# EAGLE design 副机 插座 v0.3 (EAGLE 6.3)
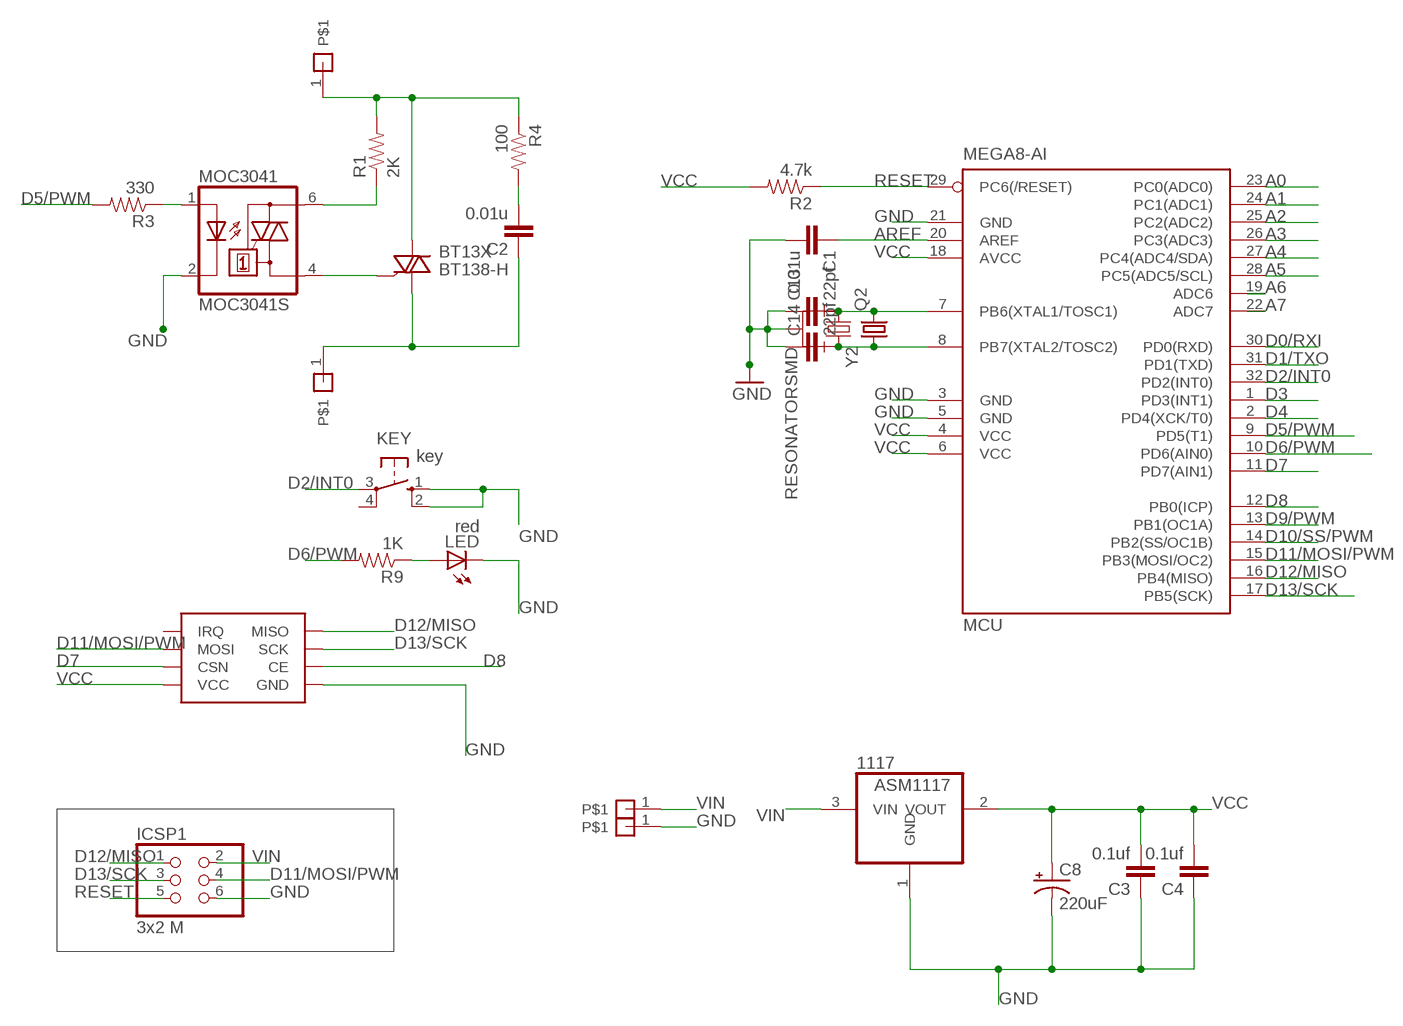
[diagram p0: schematic, sheet 1]

## Parts
1117  ASM1117  REG1117  [SOT223]
BT13X  BT138-H  [TO220BH]
C1  0.01u  CAP0603-CAP  [0603-CAP]
C2  0.01u  C-EU050-024X044  [C050-024X044]
C3  0.1uf  CAP0603-CAP  [0603-CAP]
C4  0.1uf  CAP0603-CAP  [0603-CAP]
C8  220uF  CAP_POL3528  [EIA3528]
C13  22pf  CAP0603-CAP  [0603-CAP]
C14  22pf  CAP0603-CAP  [0603-CAP]
ICSP1  3x2 M  PINHD-2X3  [2X03]
KEY  key  10-XX  [B3F-10XX]
LED  red  LED3MM  [LED3MM]
MCU  MEGA8-AI  [TQFP32-08]
MOC3041  MOC3041S  [DIL6-SMD]
Q2  CRYSTALHC49S  [HC49/S]
R1  2K  RESISTOR1206  [1206]
R2  4.7k  RESISTOR0603-RES  [0603-RES]
R3  330  RESISTOR0603-RES  [0603-RES]
R4  100  RESISTOR1206  [1206]
R9  1K  RESISTOR0603-RES  [0603-RES]
U$1  PIN1  [PIN1]
U$2  PIN1  [PIN1]
U$3  PIN1  [PIN1]
U$4  PIN1  [PIN1]
U$6  NRF  [NRF]
Y2  RESONATORSMD  [RESONATOR-SMD]

## Nets
A0: MCU.23(PC0(ADC0))
A1: MCU.24(PC1(ADC1))
A2: MCU.25(PC2(ADC2))
A3: MCU.26(PC3(ADC3))
A4: MCU.27(PC4(ADC4/SDA))
A5: MCU.28(PC5(ADC5/SCL))
A6: MCU.19(ADC6)
A7: MCU.22(ADC7)
AREF: C1.1 MCU.20(AREF)
D0/RXI: MCU.30(PD0(RXD))
D1/TXO: MCU.31(PD1(TXD))
D2/INT0: KEY.3(P) MCU.32(PD2(INT0))
D3: MCU.1(PD3(INT1))
D4: MCU.2(PD4(XCK/T0))
D5/PWM: MCU.9(PD5(T1)) R3.2
D6/PWM: MCU.10(PD6(AIN0)) R9.2
D7: MCU.11(PD7(AIN1)) U$6.P$4(CSN)
D8: MCU.12(PB0(ICP)) U$6.P$3(CE)
D9/PWM: MCU.13(PB1(OC1A))
D10/SS/PWM: MCU.14(PB2(SS/OC1B))
D11/MOSI/PWM: ICSP1.4 MCU.15(PB3(MOSI/OC2)) U$6.P$6(MOSI)
D12/MISO: ICSP1.1 MCU.16(PB4(MISO)) U$6.P$7(MISO)
D13/SCK: ICSP1.3 MCU.17(PB5(SCK)) U$6.P$5(SCK)
GND: 1117.1(GND) C1.2 C3.1 C4.1 C8.C(-) C13.1 C14.1 ICSP1.6 KEY.1(S) KEY.2(S1) LED.K(C) MCU.3(GND) MCU.5(GND) MCU.21(GND) MOC3041.2(C) U$4.1 U$6.P$1(GND) Y2.2
IN: BT13X.T2(A2) R1.2 R4.1 U$2.1
N$1: MOC3041.6(A2) R1.1
N$2: BT13X.G MOC3041.4(A1)
N$6: C2.2 R4.2
N$15: LED.A R9.1
N$34: C13.2 MCU.7(PB6(XTAL1/TOSC1)) Q2.2 Y2.1
N$35: C14.2 MCU.8(PB7(XTAL2/TOSC2)) Q2.1 Y2.3
OUT: BT13X.T1(A1) C2.1 U$1.1
P1: MOC3041.1(A) R3.1
RESET: ICSP1.5 MCU.29(PC6(/RESET)) R2.1
VCC: 1117.2(VOUT) C3.2 C4.2 C8.A(+) MCU.4(VCC) MCU.6(VCC) MCU.18(AVCC) R2.2 U$6.P$2(VCC)
VIN: 1117.3(VIN) ICSP1.2 U$3.1
Unconnected: KEY.4(P1) U$6.P$8(IRQ)

## Library data of the parts
1117 = burr-brown:REG1117: 800mA and 1A Low Dropout (LDO) Positive Regulator 1.8V, 2.5V, 2.85V, 3.3V, 5V, and Adj; MPN: REG1117; OC_FARNELL: 1097566; OC_NEWARK: 14P6981
BT13X = triac:BT138: TRIAC Source: http://www.semiconductors.philips.com BT138_SERIES_2.pdf
C1 = MY2:CAP: Capacitor Standard 0603 ceramic capacitor, and 0.1" leaded capacitor.
C2 = resistor:C-EU: CAPACITOR, European symbol
C3 C4 = MY:CAP: Capacitor Standard 0603 ceramic capacitor, and 0.1" leaded capacitor.
C8 = MY:CAP_POL: Capacitor Polarized These are standard SMD and PTH capacitors. Normally 10uF, 47uF, and 100uF in electrolytic and tantalum varieties. Always verify the external diameter of the through hole cap, it varies with capacity, voltage, and manufacturer. The EIA devices should be standard.
C13 C14 = 00my:CAP: Capacitor Standard 0603 ceramic capacitor, and 0.1" leaded capacitor.
ICSP1 = SmartPrj:PINHD-2X3: PIN HEADER
KEY = switch-omron:10-XX: OMRON SWITCH; MPN: B3F-1000; OC_FARNELL: 176432; OC_NEWARK: 36M3542
LED = led:LED: LED OSRAM: - CHIPLED LG R971, LG N971, LY N971, LG Q971, LY Q971, LO R971, LY R971 LH N974, LH R974 LS Q976, LO Q976, LY Q976 LO Q996 - Hyper CHIPLED LW Q18S LB Q993, LB Q99A, LB R99A - SideLED LS A670, LO A670, LY A670, LG A670, LP A670 LB A673, LV A673, LT A673, LW A673 LH A674 LY A675 LS A676, LA A676, LO A676, LY A676, LW A676 LS A679, LY A679, LG A679 - Hyper Micro SIDELED® LS Y876, LA Y876, LO Y876, LY Y876 LT Y87S - SmartLED LW L88C, LW L88S LB L89C, LB L89S, LG L890 LS L89K, LO L89K, LY L89K LS L896, LA L896, LO L896, LY L896 - TOPLED LS T670, LO T670, LY T670, LG T670, LP T670 LSG T670, LSP T670, LSY T670, LOP T670, LYG T670 LG T671, LOG T671, LSG T671 LB T673, LV T673, LT T673, LW T673 LH T674 LS T676, LA T676, LO T676, LY T676, LB T676, LH T676, LSB T676, LW T676 LB T67C, LV T67C, LT T67C, LS T67K, LO T67K, LY T67K, LW E67C LS E67B, LA E67B, LO E67B, LY E67B, LB E67C, LV E67C, LT E67C LW T67C LS T679, LY T679, LG T679 LS T770, LO T770, LY T770, LG T770, LP T770 LB T773, LV T773, LT T773, LW T773 LH T774 LS E675, LA E675, LY E675, LS T675 LS T776, LA T776, LO T776, LY T776, LB T776 LHGB T686 LT T68C, LB T68C - Hyper Mini TOPLED® LB M676 - Mini TOPLED Santana® LG M470 LS M47K, LO M47K, LY M47K Source: http://www.osram.convergy.de LUXEON: - LUMILED® LXK2-PW12-R00, LXK2-PW12-S00, LXK2-PW14-U00, LXK2-PW14-V00 LXK2-PM12-R00, LXK2-PM12-S00, LXK2-PM14-U00 LXK2-PE12-Q00, LXK2-PE12-R00, LXK2-PE12-S00, LXK2-PE14-T00, LXK2-PE14-U00 LXK2-PB12-K00, LXK2-PB12-L00, LXK2-PB12-M00, LXK2-PB14-N00, LXK2-PB14-P00, LXK2-PB14-Q00 LXK2-PR12-L00, LXK2-PR12-M00, LXK2-PR14-Q00, LXK2-PR14-R00 LXK2-PD12-Q00, LXK2-PD12-R00, LXK2-PD12-S00 LXK2-PH12-R00, LXK2-PH12-S00 LXK2-PL12-P00, LXK2-PL12-Q00, LXK2-PL12-R00 Source: www.luxeon.com KINGBRIGHT: KA-3528ASYC Source: www.kingbright.com
MCU = atmel:MEGA8: MICROCONTROLLER 8 Kbytes FLASH, 1 kbytes SRAM, 512 bytes EEPROM, USART, 6-channel 10 bit ADC, 2-channel 8 bit ADC Pin compatible with Atmega48, ATMega88, ATMega168 Source: avr.lbr; MPN: ATMEGA8-16AU; OC_FARNELL: 9171371; OC_NEWARK: 73M8863
MOC3041 = optocoupler:MOC30*: 6-Pin DIP Zero-Cross Optoisolators Triac Driver Output (250/400 Volt Peak) Source: http://www.fairchildsemi.com/ds/MO/MOC3043-M.pdf; MF: FAIRCHILD SEMICONDUCTOR; MPN: MOC3041S-M; OC_FARNELL: unknown; OC_NEWARK: 05C2885
Q2 = crystal:CRYSTAL: CRYSTAL; OC_FARNELL: 1667008; OC_NEWARK: unknown
R1 R4 = MY3:RESISTOR: Resistor Basic schematic elements and footprints for 0603, 1206, and PTH 1/10th watt (small) resistors.
R2 R3 R9 = MY:RESISTOR: Resistor Basic schematic elements and footprints for 0603, 1206, and PTH 1/10th watt (small) resistors.
U$1-U$4 = PKJ:PIN1
U$6 = PKJ:NRF
Y2 = MY:RESONATOR: Resonator Small SMD resonator. This is the itty bitty 10/20MHz resonators with built in caps. CSTCE10M0G55 and CSTCE20M0V53. Footprint has been reviewed closely but hasn't been tested yet.

## Net classes
0 default: width 0.254 mm, clearance 0.254 mm
1 power: width 0.381 mm
2 gnd: width 0.305 mm, drill 0.559 mm, clearance 0.254 mm
3 usbvcc: width 0.508 mm, drill 0.61 mm, clearance 0.254 mm

## Board
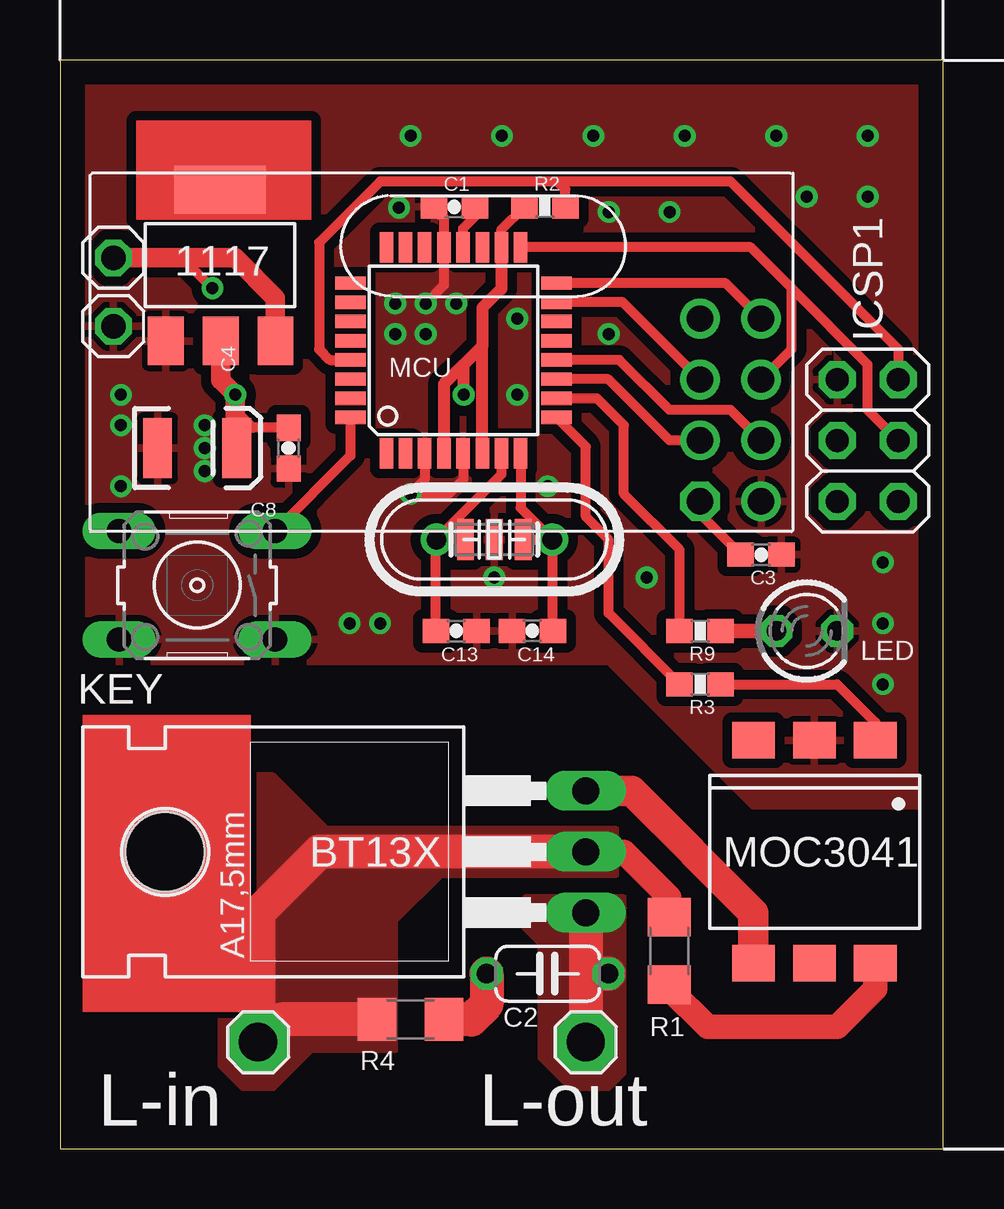
[diagram p1: board, top side]
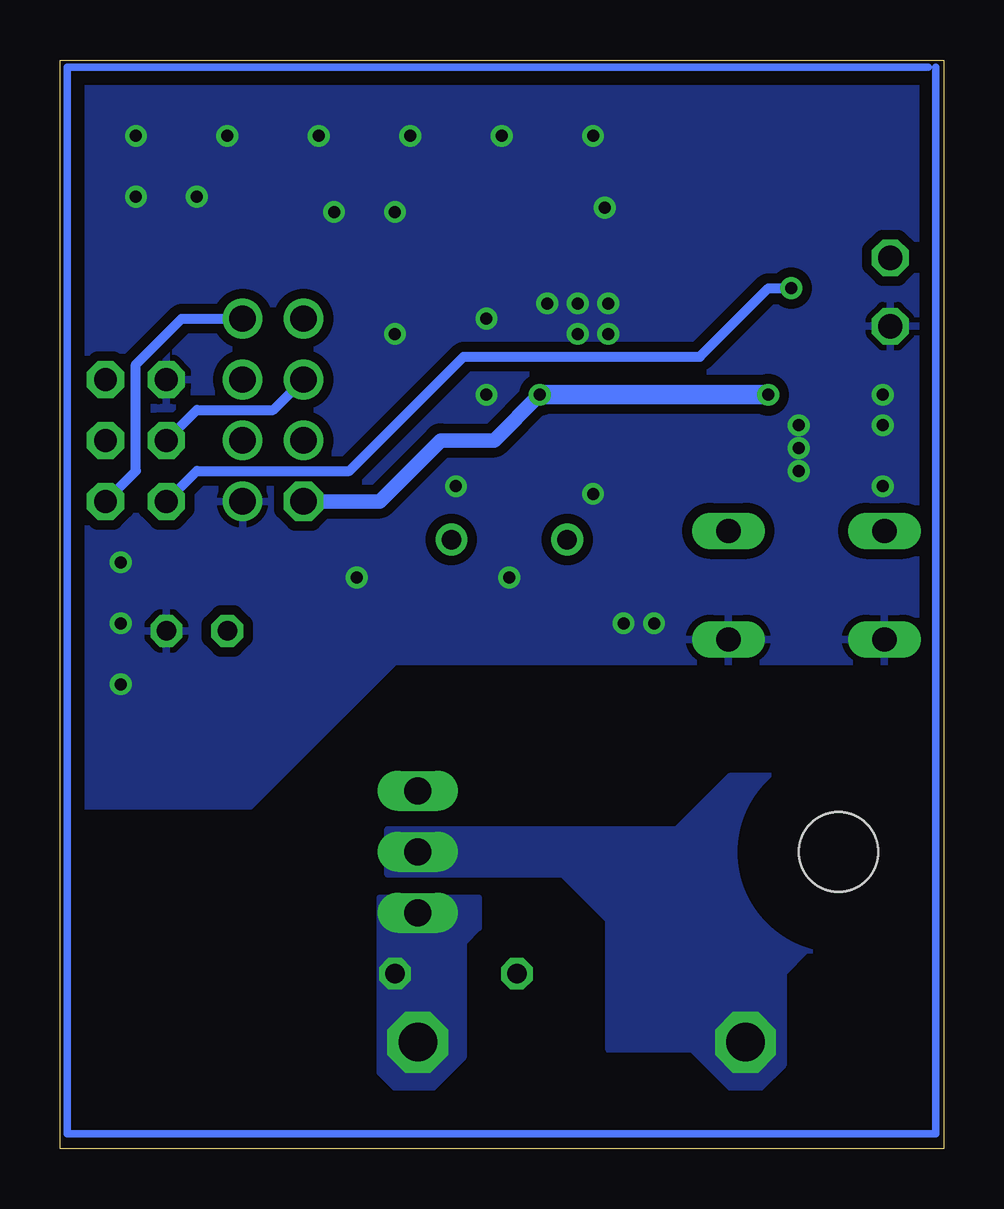
[diagram p2: board, bottom side, seen from below]

Size 36.81 x 45.39 mm. Coordinates in mm from the lower left corner, seen from the top.
Outline: 0,0 36.81,0 36.81,45.39 0,45.39 0,0
Copper layers (1*16): Top 0.035mm / dielectric 1.5mm / Bottom 0.035mm
Design rules "default": minimum track width 10mil, minimum drill 24mil, track to track 8mil, track to pad 8mil, pad to pad 8mil, via to via 8mil, smd to smd 8mil, copper to edge 40mil, drill to drill 8mil, minimum pad ring 10mil, minimum via ring 8mil, stop-mask expansion 4mil, vias tented up to drill 0mil, thermal gap 10mil

### Footprints (pad centres in the part's own frame; a part is rotated, then mirrored left to right if it is on the bottom)
SOT223 = smd 1.499 x 2.007: 1 -2.261,-3.15; 2 0.025,-3.15; 3 2.311,-3.15 | smd 3.81 x 2.007: 4 0,3.15
TO220BH = drill 1.118 long: G 2.54,-6.35; T1 -2.54,-6.35; T2 0,-6.35 | hole 3.302: 0,11.176
0603-CAP = smd 1.1 x 1: 1 -0.85,0; 2 0.85,0
C050-024X044 = drill 0.813 octagon: 1 -2.54,0; 2 2.54,0
EIA3528 = smd 1.2 x 2.5: A 1.65,0; C -1.65,0
2X03 = drill 0.95 pad 1.55 octagon: 1 -2.54,-1.27; 2 -2.54,1.27; 3 0,-1.27; 4 0,1.27; 5 2.54,-1.27; 6 2.54,1.27
B3F-10XX = drill 1.016 long: 1 -3.251,2.261; 2 3.251,2.261; 3 -3.251,-2.261; 4 3.251,-2.261
LED3MM = drill 0.813 octagon: A -1.27,0; K 1.27,0
TQFP32-08 = smd 1.27 x 0.559: 1 -4.293,2.8; 2 -4.293,2; 3 -4.293,1.2; 4 -4.293,0.4; 5 -4.293,-0.4; 6 -4.293,-1.2; 7 -4.293,-2; 8 -4.293,-2.8; 17 4.293,-2.8; 18 4.293,-2; 19 4.293,-1.2; 20 4.293,-0.4; 21 4.293,0.4; 22 4.293,1.2; 23 4.293,2; 24 4.293,2.8 | smd 0.559 x 1.27: 9 -2.8,-4.293; 10 -2,-4.293; 11 -1.2,-4.293; 12 -0.4,-4.293; 13 0.4,-4.293; 14 1.2,-4.293; 15 2,-4.293; 16 2.8,-4.293; 25 2.8,4.293; 26 2,4.293; 27 1.2,4.293; 28 0.4,4.293; 29 -0.4,4.293; 30 -1.2,4.293; 31 -2,4.293; 32 -2.8,4.293
DIL6-SMD = smd 1.78 x 1.52: 1 -2.54,-4.645; 2 0,-4.645; 3 2.54,-4.645; 4 2.54,4.645; 5 0,4.645; 6 -2.54,4.645
HC49/S = drill 0.813: 1 -2.413,0; 2 2.413,0
1206 = smd 1.6 x 1.8: 1 -1.4,0; 2 1.4,0
0603-RES = smd 1.1 x 1: 1 -0.85,0; 2 0.85,0
PIN1 = drill 1.016 octagon: 1 0,0
NRF = drill 1.1: P$1 2.54,-2.54; P$3 2.54,0; P$4 0,0; P$5 2.54,2.54; P$6 0,2.54; P$7 2.54,5.08; P$8 0,5.08 | drill 1.1 octagon: P$2 0,-2.54
RESONATOR-SMD = smd 0.7 x 1.7: 1 -1.2,0; 2 0,0; 3 1.2,0

### Placement (x,y rotation side)
1117  6.67,36.83 0 top
BT13X  15.56,12.38 90 top
C1  16.43,39.27 180 top
C2  20.32,7.3 180 top
C3  29.21,24.77 180 top
C4  9.53,29.21 90 top
C8  5.71,29.21 0 top
C13  16.51,21.59 180 top
C14  19.68,21.59 0 top
ICSP1  33.66,29.53 90 top
KEY  5.71,23.49 180 top
LED  31.11,21.59 0 top
MCU  16.4,33.29 90 top
MOC3041  31.43,12.38 180 top
Q2  18.1,25.4 180 top
R1  25.39,8.26 90 top
R2  20.21,39.28 180 top
R3  26.67,19.37 180 top
R4  14.61,5.4 0 top
R9  26.67,21.59 180 top
U$1  21.91,4.45 0 top
U$2  8.26,4.45 0 top
U$3  2.22,37.15 0 top
U$4  2.22,34.29 0 top
U$6  26.67,29.53 0 top
Y2  18.1,25.4 0 top

### Tracks (layer width: path | path; a pad name or v marks a point on that pad's centre or on a via)
AREF
  Top 0.406: MCU.20 16.8,38.37 17.28,38.86 C1.1
D2/INT0
  Top 0.406: MCU.32 12.1,28.89 KEY.3
D5/PWM
  Top 0.406: R3.2 22.86,22.33 22.86,25.4 21.91,26.35 21.91,29.27 MCU.9
D6/PWM
  Top 0.406: MCU.10 22.37,31.29 23.49,30.16 23.49,27.31 25.82,24.98 R9.2
D7
  Top 0.406: U$6.P$4 25.4,29.53 22.84,32.09 MCU.11
D8
  Top 0.406: U$6.P$3 27.94,30.8 25.4,30.8 23.31,32.89 MCU.12
D11/MOSI/PWM
  Top 0.406: U$6.P$6 23.45,35.29 MCU.15
  Bottom 0.406: ICSP1.4 31.11,30.8 27.94,30.8 U$6.P$6
D12/MISO
  Top 0.406: U$6.P$7 27.73,36.09 MCU.16
  Bottom 0.406: ICSP1.1 33.66,28.26 33.66,32.7 31.75,34.61 U$6.P$7
D13/SCK
  Top 0.406: U$6.P$5 30.48,33.34 30.48,35.88 | 30.48,35.88 28.78,37.58 MCU.17 | ICSP1.3 33.66,30.8 33.66,32.7 30.48,35.88
GND  (via drill 0.5)
  Top 0.406: MCU.3 15.2,27.9 v14.61,27.31 16.19,27.31 16.8,27.91 MCU.5 | v15.24,35.24 16,36 MCU.21 16,38.8 15.54,39.26 15.57,39.26 C1.2
  other vias: 24.45,23.81 16.51,35.24 33.66,39.69 31.11,39.69 25.4,39.05 22.86,39.05 19.05,31.43 6.03,28.26 34.29,21.91 34.29,24.45 34.29,19.37 20.32,27.62 18.1,23.81 14.12,39.23 15.24,33.97 13.97,33.97 13.97,35.24 33.66,42.23 29.84,42.23 26.04,42.23 22.22,42.23 18.41,42.23 14.61,42.23 22.22,42.23 22.86,33.97 12.06,21.91 13.34,21.91 2.54,30.16 2.54,27.62 2.54,31.43 19.05,34.61 6.03,29.21 6.03,30.16
  pour Bottom (isolate 0.406): 0.64,44.45 36.2,44.45 36.2,14.29 28.89,14.29 22.86,20.32 0.64,20.32
  pour Top (isolate 0.406): 0.64,44.45 36.2,44.45 36.2,14.29 28.89,14.29 22.86,20.32 0.64,20.32
IN  (via drill 1.6 pad 2.54)
  Top 1.016: BT13X.T2 23.49,12.38 25.39,10.49 R1.2
  Top 1.422: R4.1 9.21,5.4 U$2.1 8.26,9.84 10.79,12.38 BT13X.T2
  other vias: 8.26,4.45
  pour Top (rank 5, no thermals): 23.18,13.34 11.11,13.34 8.89,15.56 3.17,15.56 1.91,14.29 1.91,9.21 2.86,8.26 5.71,8.26 6.67,7.3 6.67,3.49 7.62,2.54 8.89,2.54 10.48,4.13 13.97,4.13 13.97,9.53 15.88,11.43 23.18,11.43
  pour Bottom (rank 5, no thermals): 23.18,13.34 11.11,13.34 8.89,15.56 3.17,15.56 1.91,14.29 1.91,9.21 2.86,8.26 5.71,8.26 6.67,7.3 6.67,3.49 7.62,2.54 8.89,2.54 10.48,4.13 13.97,4.13 13.97,9.53 15.88,11.43 23.18,11.43
N$1
  Top 1.016: MOC3041.6 33.97,6.67 32.39,5.08 26.99,5.08 25.39,6.68 R1.1
N$2
  Top 1.27: BT13X.G 23.81,14.92 28.89,9.84 MOC3041.4
N$6
  Top 1.422: C2.2 17.78,6.03 17.14,5.4 R4.2
N$14
  Bottom 0.305: 0.64,45.08 36.51,45.08 36.51,0.64 0.32,0.64 0.32,45.08
N$15
  Top 0.61: R9.1 LED.A
N$34
  Top 0.406: MCU.7 18.4,28.11 Q2.2 | C13.2 15.66,25.38 Q2.2 | Y2.1 Q2.2
N$35
  Top 0.406: MCU.8 19.2,26.71 Q2.1 | C14.2 20.54,25.38 Q2.1 | Y2.3 Q2.1
OUT  (via drill 1.6 pad 2.54)
  Top 1.422: BT13X.T1 21.91,7.3 | 21.91,7.3 U$1.1 | C2.1 21.91,7.3
  other vias: 21.91,4.45
  pour Top (isolate 0.61, rank 5, no thermals): 23.49,10.48 19.37,10.48 19.37,9.21 20,8.57 20,3.81 21.27,2.54 22.86,2.54 23.49,3.17
  pour Bottom (isolate 0.61, rank 5, no thermals): 23.49,10.48 19.37,10.48 19.37,9.21 20,8.57 20,3.81 21.27,2.54 22.86,2.54 23.49,3.17
P1
  Top 0.406: R3.1 32.39,19.37 33.97,17.78 MOC3041.1
RESET
  Top 0.406: 20.73,40.32 27.94,40.32 34.93,33.34 ICSP1.5 | 20.73,40.32 13.34,40.32 10.79,37.78 10.79,33.34 11.25,32.89 MCU.29 | R2.1 21.06,39.99 20.73,40.32
VCC  (via drill 0.5)
  Top 0.406: C3.2 26.67,26.45 U$6.P$2 | C8.A 7.3,28.95 | MCU.18 18.4,38.32 R2.2 | C4.2 8.04,30.06 7.3,30.8
  Top 0.508: 17.6,33.47 16.83,32.7 | 16.83,32.7 16,31.87 MCU.4 | MCU.6 17.6,33.47 | v16.83,31.43 16.83,32.7 | MCU.18 18.4,35.86 17.6,35.06 17.6,33.47
  Top 0.813: 1117.2 6.69,32.04 v7.3,31.43 7.3,30.8 7.3,28.95
  Bottom 0.61: U$6.P$2 23.49,26.99 20.95,29.53 18.73,29.53 v16.83,31.43
  Bottom 0.813: v7.3,31.43 v16.83,31.43
VIN  (via drill 0.5)
  Top 0.406: v6.35,35.88 5.08,37.15 4.45,37.15
  Top 0.813: U$3.1 4.45,37.15 7.3,37.15 8.98,35.47 1117.3
  Bottom 0.406: ICSP1.2 31.11,28.26 24.76,28.26 20,33.02 10.16,33.02 7.3,35.88 v6.35,35.88
(copper drawn outside any net)
  shapes: Top area x2

### Text on the board
tPlace: L-in | L-out
tStop: v